# EAGLE schematic SHIFFTER_BOARD (EAGLE 7.5.0)
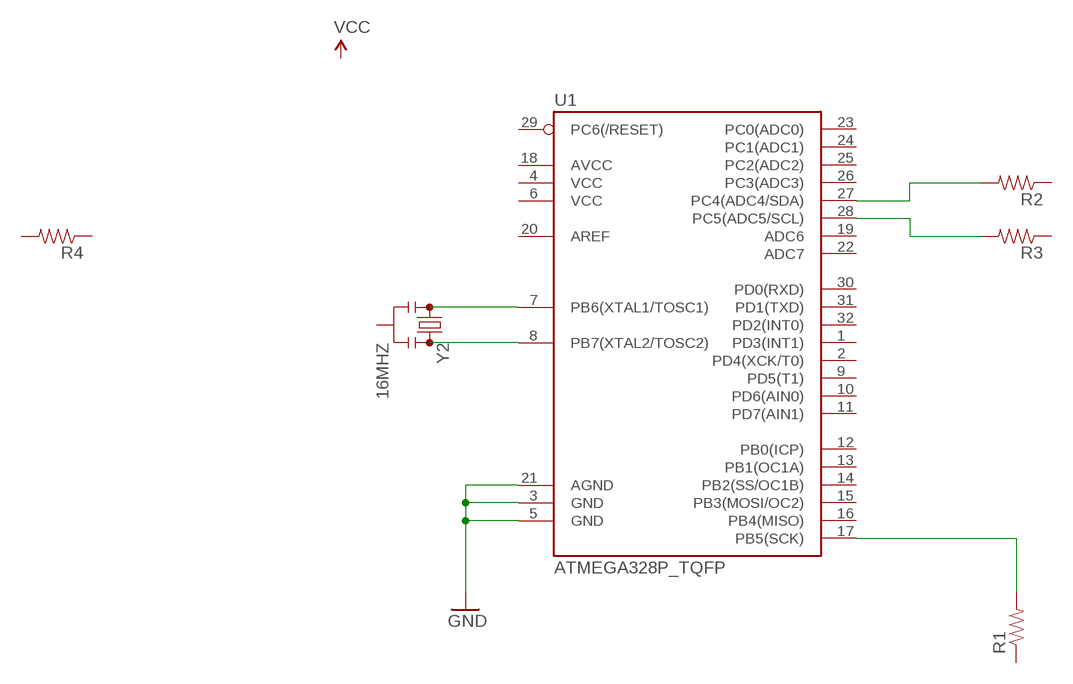
[diagram p0: schematic, sheet 1]

## Parts
R1  RESISTOR0805-RES  [0805]
R2  RESISTOR0805-RES  [0805]
R3  RESISTOR0805-RES  [0805]
R4  RESISTOR0805-RES  [0805]
U1  ATMEGA328P_TQFP  [TQFP32-08]
Y2  16MHZ  RESONATOR16MHZ  [RESONATOR-SMD]

## Nets
GND: U1.3(GND) U1.5(GND) U1.21(AGND)
N$1: R1.2 U1.17(PB5(SCK))
N$2: R3.2 U1.28(PC5(ADC5/SCL))
N$3: R2.2 U1.27(PC4(ADC4/SDA))
N$4: U1.7(PB6(XTAL1/TOSC1)) Y2.1
N$5: U1.8(PB7(XTAL2/TOSC2)) Y2.3
Unconnected: R1.1 R2.1 R3.1 R4.1 R4.2 U1.1(PD3(INT1)) U1.2(PD4(XCK/T0)) U1.4(VCC) U1.6(VCC) U1.9(PD5(T1)) U1.10(PD6(AIN0)) U1.11(PD7(AIN1)) U1.12(PB0(ICP)) U1.13(PB1(OC1A)) U1.14(PB2(SS/OC1B)) U1.15(PB3(MOSI/OC2)) U1.16(PB4(MISO)) U1.18(AVCC) U1.19(ADC6) U1.20(AREF) U1.22(ADC7) U1.23(PC0(ADC0)) U1.24(PC1(ADC1)) U1.25(PC2(ADC2)) U1.26(PC3(ADC3)) U1.29(PC6(/RESET)) U1.30(PD0(RXD)) U1.31(PD1(TXD)) U1.32(PD2(INT0)) Y2.2

## Library data of the parts
R1-R4 = SparkFun-Resistors:RESISTOR: Resistor Basic schematic elements and footprints for 0603, 1206, and PTH resistors.
U1 = SparkFun-DigitalIC:ATMEGA328P_TQFP; PROD_ID: IC-09069
Y2 = SparkFun-FreqCtrl:RESONATOR: Resonator Small SMD resonator. Used, eg, on the Arduino Pro/ Pro Mini boards. 8MHz- XTAL-08895 16MHz- XTAL-08900; PROD_ID: XTAL-08900